# EAGLE design ai_breakout_rn52 (EAGLE 7.1.0)
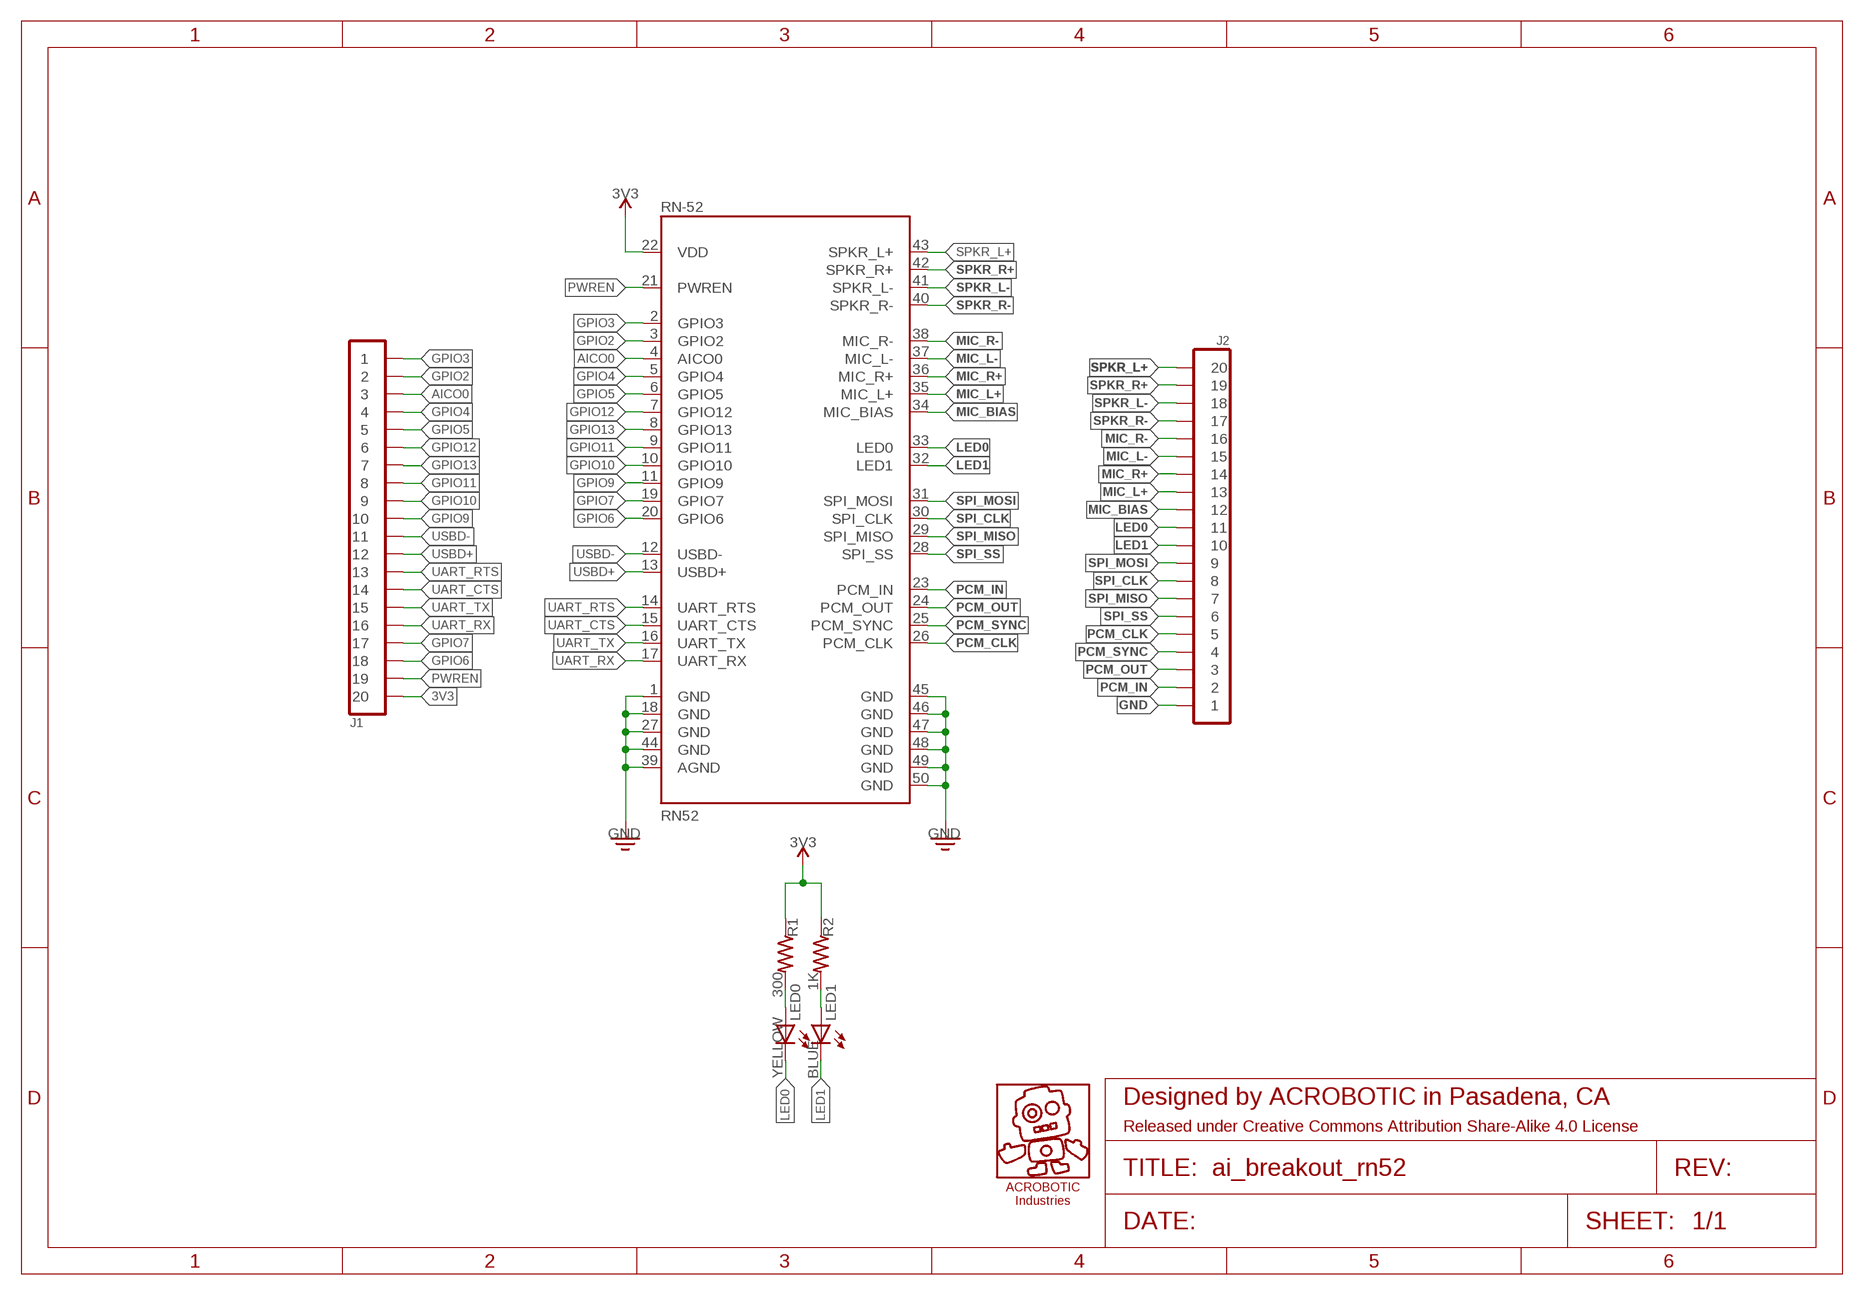
[diagram p0: schematic, sheet 1]

## Parts
FRAME1  FRAME-LETTER  [CREATIVE-COMMONS]
J1  1X20  [1X20]
J2  1X20  [1X20]
LED0  YELLOW  LED0603  [LED-0603]
LED1  BLUE  LED0603  [LED-0603]
R1  300  RES0603  [RES-0603]
R2  1K  RES0603  [RES-0603]
RN-52  RN52  [RN52]
U$3  AI-LOGOXS  [AI-LOGO-XS]

## Nets
3V3 [power]: J1.20 R1.1 R2.1 RN-52.22(VDD)
AICO0: J1.3 RN-52.4(AICO0)
GND [power]: J2.1 RN-52.1(GND) RN-52.18(GND) RN-52.27(GND) RN-52.39(AGND) RN-52.44(GND) RN-52.45(GND) RN-52.46(GND) RN-52.47(GND) RN-52.48(GND) RN-52.49(GND) RN-52.50(GND)
GPIO2: J1.2 RN-52.3(GPIO2)
GPIO3: J1.1 RN-52.2(GPIO3)
GPIO4: J1.4 RN-52.5(GPIO4)
GPIO5: J1.5 RN-52.6(GPIO5)
GPIO6: J1.18 RN-52.20(GPIO6)
GPIO7: J1.17 RN-52.19(GPIO7)
GPIO9: J1.10 RN-52.11(GPIO9)
GPIO10: J1.9 RN-52.10(GPIO10)
GPIO11: J1.8 RN-52.9(GPIO11)
GPIO12: J1.6 RN-52.7(GPIO12)
GPIO13: J1.7 RN-52.8(GPIO13)
LED0: J2.11 LED0.C RN-52.33(LED0)
LED1: J2.10 LED1.C RN-52.32(LED1)
MIC_BIAS: J2.12 RN-52.34(MIC_BIAS)
MIC_L+: J2.13 RN-52.35(MIC_L+)
MIC_L-: J2.15 RN-52.37(MIC_L-)
MIC_R+: J2.14 RN-52.36(MIC_R+)
MIC_R-: J2.16 RN-52.38(MIC_R-)
N$6: LED0.A R1.2
N$7: LED1.A R2.2
PCM_CLK: J2.5 RN-52.26(PCM_CLK)
PCM_IN: J2.2 RN-52.23(PCM_IN)
PCM_OUT: J2.3 RN-52.24(PCM_OUT)
PCM_SYNC: J2.4 RN-52.25(PCM_SYNC)
PWREN: J1.19 RN-52.21(PWREN)
SPI_CLK: J2.8 RN-52.30(SPI_CLK)
SPI_MISO: J2.7 RN-52.29(SPI_MISO)
SPI_MOSI: J2.9 RN-52.31(SPI_MOSI)
SPI_SS: J2.6 RN-52.28(SPI_SS)
SPKR_L+: J2.20 RN-52.43(SPKR_L+)
SPKR_L-: J2.18 RN-52.41(SPKR_L-)
SPKR_R+: J2.19 RN-52.42(SPKR_R+)
SPKR_R-: J2.17 RN-52.40(SPKR_R-)
UART_CTS: J1.14 RN-52.15(UART_CTS)
UART_RTS: J1.13 RN-52.14(UART_RTS)
UART_RX: J1.16 RN-52.17(UART_RX)
UART_TX: J1.15 RN-52.16(UART_TX)
USBD+: J1.12 RN-52.13(USBD+)
USBD-: J1.11 RN-52.12(USBD-)

## Library data of the parts
FRAME1 = Ai_Miscellany:FRAME-LETTER: Schematic Frame A4 (8.5x11) US Letter frame based on the built-in A4-LOC frame.; REV: 1.1
J1 J2 = Ai_Connectors:1X20
LED0 LED1 = Ai_LED:LED
R1 R2 = Ai_Passives:RES
RN-52 = Ai_RF:RN52
U$3 = Ai_Miscellany:AI-LOGO

## Net classes
0 default: width 0.254 mm
1 power: width 0.305 mm

## Board
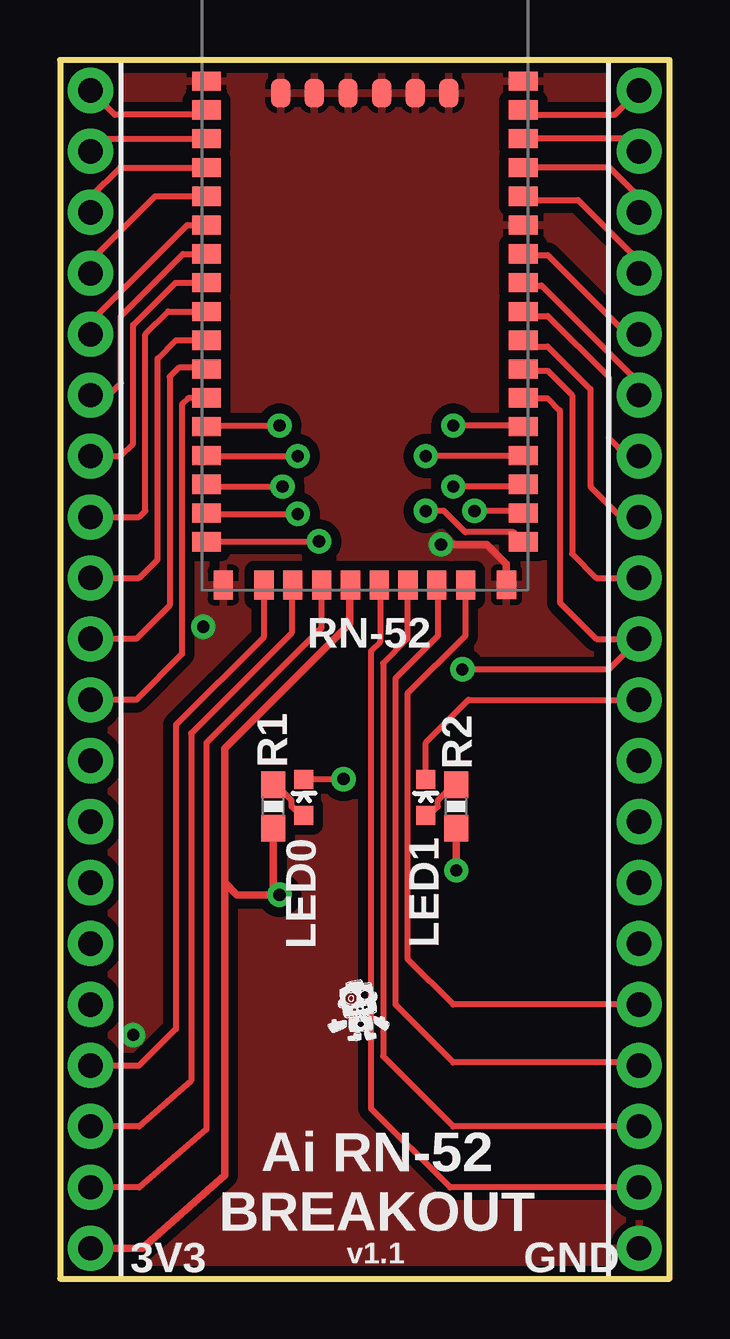
[diagram p1: board, top side]
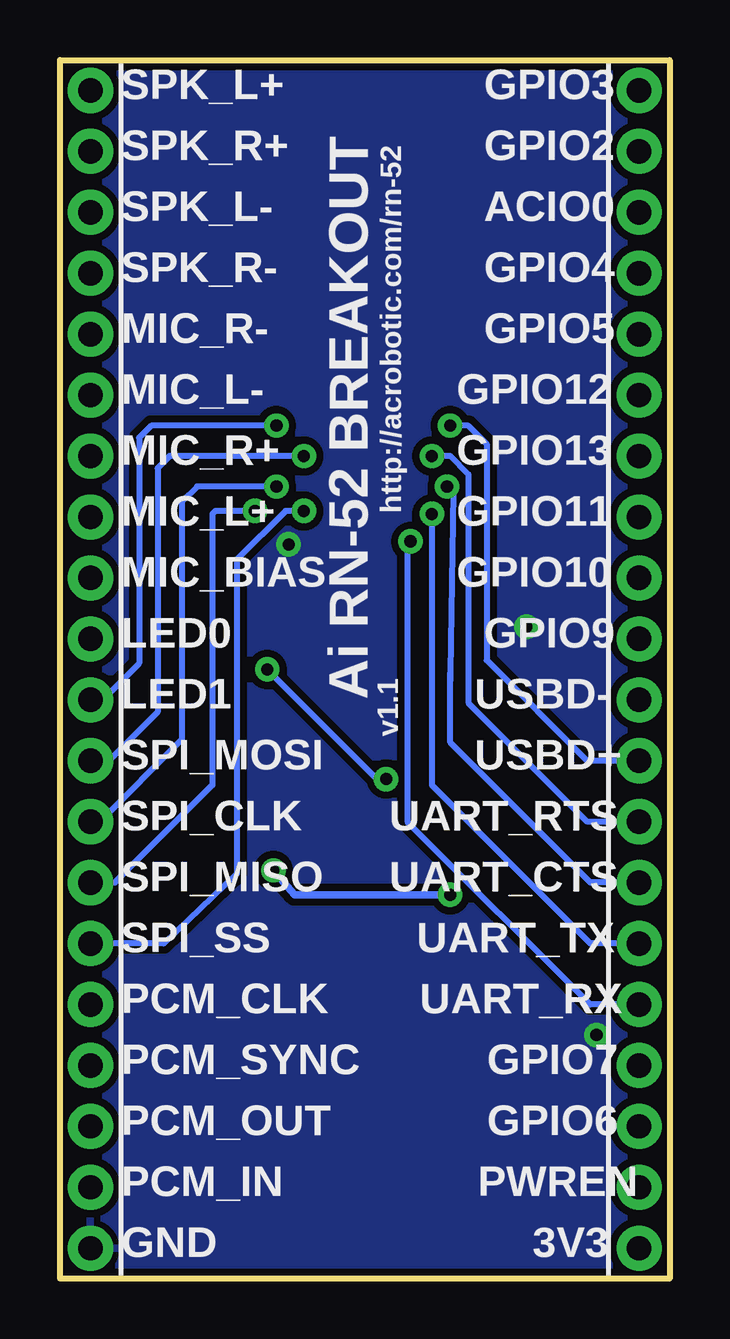
[diagram p2: board, bottom side, seen from below]

Size 25.4 x 50.8 mm. Coordinates in mm from the lower left corner, seen from the top.
Outline: 0,0 25.4,0 25.4,50.8 0,50.8 0,0
Copper layers (1*16): Top 0.035mm / dielectric 1.5mm / Bottom 0.035mm
Design rules "ai_2layer": minimum track width 7mil, minimum drill 15mil, track to track 8mil, track to pad 8mil, pad to pad 8mil, via to via 8mil, smd to smd 8mil, copper to edge 8mil, drill to drill 8mil, minimum pad ring 12mil, minimum via ring 10mil, stop-mask expansion 4mil, vias tented up to drill 20mil, thermal gap 10mil

### Footprints (pad centres in the part's own frame; a part is rotated, then mirrored left to right if it is on the bottom)
1X20 = drill 1.016 pad 1.88: 1 -24.13,0; 2 -21.59,0; 3 -19.05,0; 4 -16.51,0; 5 -13.97,0; 6 -11.43,0; 7 -8.89,0; 8 -6.35,0; 9 -3.81,0; 10 -1.27,0; 11 1.27,0; 12 3.81,0; 13 6.35,0; 14 8.89,0; 15 11.43,0; 16 13.97,0; 17 16.51,0; 18 19.05,0; 19 21.59,0; 20 24.13,0
LED-0603 = smd 0.8 x 0.8: A 0,-0.75; C 0,0.75
RES-0603 = smd 1.1 x 1: 1 -0.9,0; 2 0.9,0
RN52 = smd 1.2 x 0.8: 1 -6.6,9.53; 2 -6.6,8.33; 3 -6.6,7.13; 4 -6.6,5.93; 5 -6.6,4.73; 6 -6.6,3.53; 7 -6.6,2.33; 8 -6.6,1.13; 9 -6.6,-0.07; 10 -6.6,-1.27; 11 -6.6,-2.47; 12 -6.6,-3.67; 13 -6.6,-4.87; 14 -6.6,-6.07; 15 -6.6,-7.27; 16 -6.6,-8.47; 17 -6.6,-9.67; 28 6.6,-9.67; 29 6.6,-8.47; 30 6.6,-7.27; 31 6.6,-6.07; 32 6.6,-4.87; 33 6.6,-3.67; 34 6.6,-2.47; 35 6.6,-1.27; 36 6.6,-0.07; 37 6.6,1.13; 38 6.6,2.33; 39 6.6,3.53; 40 6.6,4.73; 41 6.6,5.93; 42 6.6,7.13; 43 6.6,8.33; 44 6.6,9.53 | smd 0.8 x 1.2: 18 -5.9,-11.47; 19 -4.2,-11.47; 20 -3,-11.47; 21 -1.8,-11.47; 22 -0.6,-11.47; 23 0.6,-11.47; 24 1.8,-11.47; 25 3,-11.47; 26 4.2,-11.47; 27 5.9,-11.46; 45 3.5,9.03; 46 2.1,9.03; 47 0.7,9.03; 48 -0.7,9.03; 49 -2.1,9.03; 50 -3.5,9.03

### Placement (x,y rotation side)
FRAME1  13.97,-1.27 0 top
J1  1.27,25.4 270 top
J2  24.13,25.4 90 top
LED0  10.16,20.07 0 top
LED1  15.24,20.07 0 top
R1  8.89,19.68 90 top
R2  16.51,19.68 90 top
RN-52  12.7,40.39 0 top
U$3  12.45,11.18 0 top

### Tracks (layer width: path | path; a pad name or v marks a point on that pad's centre or on a via)
3V3  (via drill 0.51)
  Top 0.305: J1.20 3.43,1.27 6.86,4.32 6.86,16.51 | RN-52.22 12.06,28.88 12.06,27.3 6.86,22.1 6.86,16.51 | v16.51,17.02 R2.1 | 6.86,16.51 7.37,16 v9.14,16 9.14,16.13 8.89,16.38 R1.1
  Bottom 0.305: v9.14,16 15.62,16 v16.51,17.02
AICO0
  Top 0.254: J1.3 1.27,45.09 2.5,46.32 RN-52.4
GND  (via drill 0.51)
  Top 0.305: v15.88,30.61 17.78,30.61 18.6,29.79 RN-52.27
  other vias: 3.05,10.16 5.97,27.18
  pour Bottom (isolate 0.305): 0,50.8 25.4,50.8 25.4,0 0,0
  pour Top (isolate 0.406): 0,50.8 25.4,50.8 25.4,0 0,0
GPIO2
  Top 0.254: J1.2 1.8,47.52 RN-52.3
GPIO3
  Top 0.254: RN-52.2 5.9,48.51 2.29,48.51 J1.1
GPIO4
  Top 0.254: J1.4 1.27,42.42 3.97,45.12 RN-52.5
GPIO5
  Top 0.254: J1.5 1.27,39.88 5.31,43.92 RN-52.6
GPIO6
  Top 0.254: J1.18 3.3,6.35 5.46,8.26 5.47,22.74 9.65,26.92 9.65,28.87 RN-52.20
GPIO7
  Top 0.254: RN-52.19 8.5,26.76 4.83,23.08 4.83,10.41 3.3,8.89 J1.17
GPIO9
  Top 0.254: RN-52.11 6.04,37.97 4.95,37.97 4.57,37.59 4.57,28.07 3.17,26.67 J1.10
GPIO10
  Top 0.254: J1.9 3.3,29.21 4.06,29.97 4.06,38.35 4.83,39.12 RN-52.10
GPIO11
  Top 0.254: J1.8 3.3,31.75 3.56,32 3.56,39.37 4.5,40.32 RN-52.9
GPIO12
  Top 0.254: J1.6 2.03,36.83 2.54,37.34 2.54,40.13 5.12,42.72 RN-52.7
GPIO13
  Top 0.254: J1.7 2.54,34.29 3.05,34.8 3.05,39.75 4.81,41.52 RN-52.8
LED0  (via drill 0.51)
  Top 0.254: RN-52.33 19.31,36.7 20.32,36.7 20.83,36.2 20.83,28.19 22.35,26.67 J2.11 22.86,25.4 v16.76,25.4 | v11.81,20.83 11.57,20.82 LED0.C
  Bottom 0.254: v16.76,25.4 12.19,20.83 v11.81,20.83
LED1  (via drill 0.51)
  Top 0.254: LED1.C 15.24,22.35 17.02,24.13 J2.10 | RN-52.32 19.26,35.56 v16.38,35.56
  Bottom 0.254: v16.38,35.56 21.59,35.56 22.1,35.05 22.1,25.65 23.62,24.13 J2.10
MIC_BIAS
  Top 0.254: RN-52.34 19.37,37.85 20.32,37.85 21.34,36.83 21.34,30.23 22.35,29.21 J2.12
MIC_L+
  Top 0.254: RN-52.35 19.55,38.86 20.32,38.86 22.1,37.08 22.1,33.02 23.37,31.75 J2.13
MIC_L-
  Top 0.254: RN-52.37 19.41,41.4 20.07,41.4 24.13,37.34 J2.15
MIC_R+
  Top 0.254: RN-52.36 19.48,40.13 20.32,40.13 22.86,37.59 22.86,35.05 23.62,34.29 J2.14
MIC_R-
  Top 0.254: RN-52.38 19.34,42.67 20.32,42.67 23.62,39.37 J2.16
N$6
  Top 0.254: LED0.A 10.04,19.43 9.91,19.43 9.65,19.68 9.65,19.94 9.06,20.54 R1.2
N$7
  Top 0.254: LED1.A 15.25,19.3 15.37,19.3 15.75,19.68 15.75,19.94 16.34,20.54 R2.2
PCM_CLK
  Top 0.254: RN-52.26 16.89,28.91 16.89,26.8 14.48,24.38 14.48,13.34 16.38,11.43 J2.5
PCM_IN
  Top 0.254: RN-52.23 13.34,28.82 13.34,26.54 12.95,26.16 12.95,7.11 16.26,3.81 J2.2
PCM_OUT
  Top 0.254: RN-52.24 14.48,28.89 14.48,26.67 13.46,25.65 13.46,9.27 16.38,6.35 J2.3
PCM_SYNC
  Top 0.254: RN-52.25 15.75,28.87 15.75,26.8 13.97,25.02 13.97,11.43 16.38,9.02 24,9.02 J2.4
PWREN
  Top 0.254: J1.19 3.3,3.81 6.1,6.22 6.1,22.33 10.9,27.14 RN-52.21
SPI_CLK  (via drill 0.51)
  Top 0.254: RN-52.30 19.2,33.02 v16.38,33.02
  Bottom 0.254: v16.38,33.02 19.68,33.02 20.32,32.38 20.32,22.48 23.75,19.05 J2.8
SPI_MISO  (via drill 0.51)
  Top 0.254: RN-52.29 19.21,32 v17.27,32
  Bottom 0.254: v17.27,32 18.92,32 19.05,31.88 19.05,20.57 23.11,16.51 J2.7
SPI_MOSI  (via drill 0.51)
  Top 0.254: RN-52.31 19.27,34.29 v15.24,34.29
  Bottom 0.254: v15.24,34.29 20.83,34.29 21.34,33.78 21.34,23.62 23.37,21.59 J2.9
SPI_SS  (via drill 0.51)
  Top 0.254: RN-52.28 18.9,31.11 16.89,31.11 16,32 v15.24,32
  Bottom 0.254: J2.6 21.08,13.97 18.03,16.89 18.03,29.97 16,32 v15.24,32
SPKR_L+
  Top 0.254: RN-52.43 19.5,48.51 23.11,48.51 J2.20
SPKR_L-
  Top 0.254: J2.18 24.13,45.09 22.9,46.32 RN-52.41
SPKR_R+
  Top 0.254: J2.19 23.6,47.52 RN-52.42
SPKR_R-
  Top 0.254: RN-52.40 19.46,44.96 21.59,44.96 24.13,42.42 J2.17
UART_CTS  (via drill 0.51)
  Top 0.254: RN-52.15 6.2,33.02 v9.27,33.02
  Bottom 0.254: v9.27,33.02 9.02,32.77 9.14,25.27 | 9.14,25.27 9.14,24.89 | J1.14 3.3,16.51 9.14,22.35 9.14,25.27
UART_RTS  (via drill 0.51)
  Top 0.254: RN-52.14 6.13,34.29 v9.91,34.29
  Bottom 0.254: J1.13 3.43,19.05 8.38,24 8.38,33.53 9.14,34.29 v9.91,34.29
UART_RX  (via drill 0.51)
  Top 0.254: RN-52.17 6.12,30.73 v10.79,30.73
  Bottom 0.254: v10.79,30.73 10.92,30.61 10.92,19.05 3.3,11.43 J1.16
UART_TX  (via drill 0.51)
  Top 0.254: RN-52.16 6.19,31.88 v9.91,31.88
  Bottom 0.254: v9.91,31.88 9.91,20.57 3.3,13.97 J1.15
USBD+  (via drill 0.51)
  Top 0.254: RN-52.13 6.14,35.56 v9.14,35.56
  Bottom 0.254: J1.12 3.43,21.59 7.62,25.78 7.62,34.8 8.38,35.56 v9.14,35.56
USBD-
  Top 0.254: RN-52.12 6.09,36.7 5.33,36.7 5.08,36.45 5.08,26.04 3.17,24.13 J1.11

### Text on the board
tPlace: 3V3 | GND
bPlace: GPIO3 | SPK_L+ | GPIO2 | SPK_R+ | ACIO0 | SPK_L- | GPIO4 | SPK_R- | GPIO5 | MIC_R- | GPIO12 | MIC_L- | GPIO13 | MIC_R+ | GPIO11 | MIC_L+ | GPIO10 | MIC_BIAS | GPIO9 | LED0 | USBD- | LED1 | USBD+ | SPI_MOSI | UART_RTS | SPI_CLK | UART_CTS | SPI_MISO | UART_TX | SPI_SS | UART_RX | PCM_CLK | GPIO7 | PCM_SYNC | GPIO6 | PCM_OUT | PWREN | PCM_IN | 3V3 | GND
tNames: Ai RN-52 / BREAKOUT | v1.1
bNames: Ai RN-52 BREAKOUT | http://acrobotic.com/rn-52 | v1.1
tDocu: @MakerBro